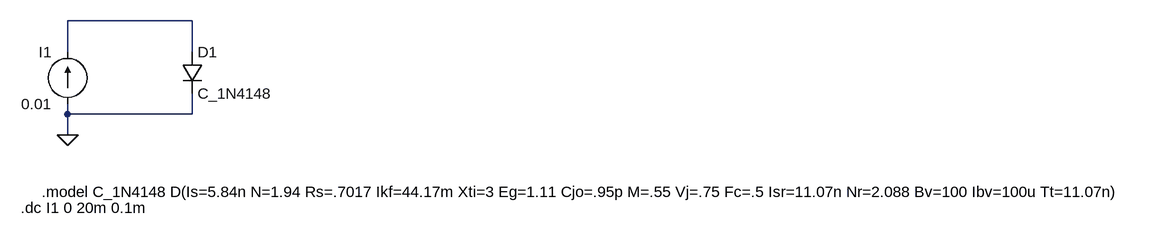
[diagram p0: schematic 1N4148_Vf_Test.asc]
1N4148_Vf_Test.asc, the LTspice schematic file:
Version 4.1
SHEET 1 1884 680
WIRE 256 64 64 64
WIRE 64 112 64 64
WIRE 256 112 256 64
WIRE 64 208 64 192
WIRE 256 208 256 176
WIRE 256 208 64 208
WIRE 64 240 64 208
FLAG 64 240 0
SYMBOL diode 240 112 R0
SYMATTR InstName D1
SYMATTR Value C_1N4148
SYMBOL current 64 192 R180
WINDOW 0 24 80 Left 2
WINDOW 3 24 0 Left 2
WINDOW 123 0 0 Left 0
WINDOW 39 0 0 Left 0
SYMATTR InstName I1
SYMATTR Value 0.01
TEXT 24 328 Left 2 !.model C_1N4148 D(Is=5.84n N=1.94 Rs=.7017 Ikf=44.17m Xti=3 Eg=1.11 Cjo=.95p M=.55 Vj=.75 Fc=.5 Isr=11.07n Nr=2.088 Bv=100 Ibv=100u Tt=11.07n)
TEXT -8 352 Left 2 !.dc I1 0 20m 0.1m

The netlist it stands for:
* 1N4148_Vf_Test.asc
D1 N001 0 C_1N4148
I1 0 N001 0.01
.model D D
.lib standard.dio
.model C_1N4148 D(Is=5.84n N=1.94 Rs=.7017 Ikf=44.17m Xti=3 Eg=1.11 Cjo=.95p M=.55 Vj=.75 Fc=.5 Isr=11.07n Nr=2.088 Bv=100 Ibv=100u Tt=11.07n)
.dc I1 0 20m 0.1m
.backanno
.end